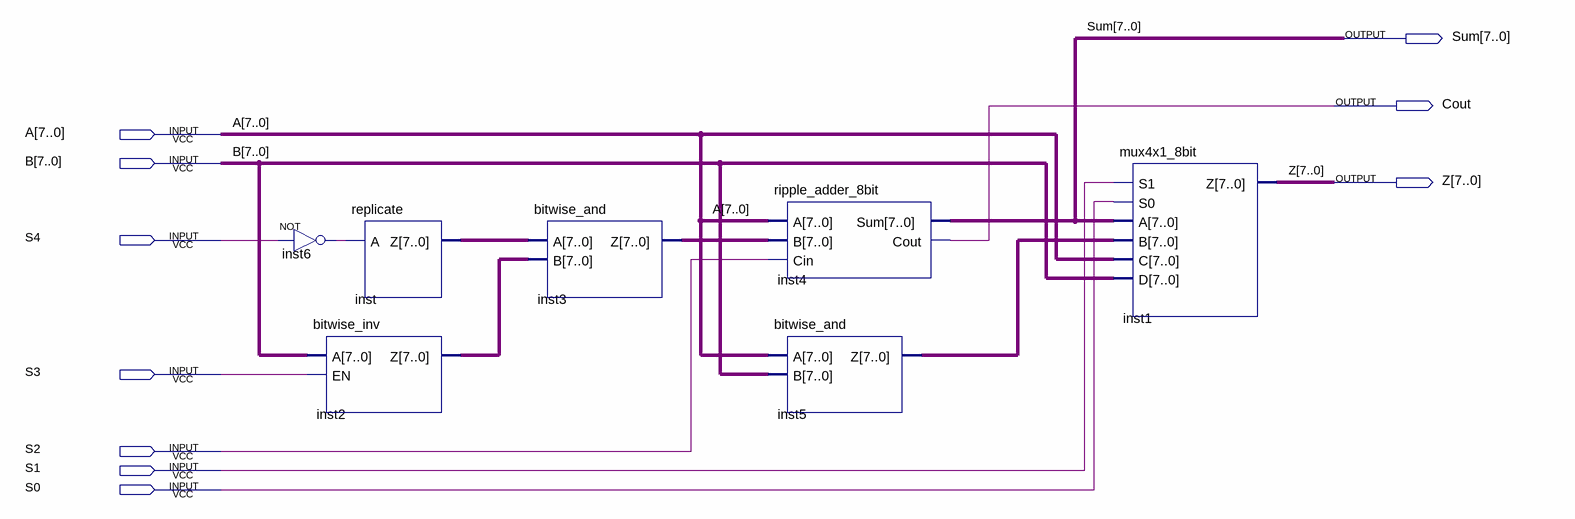
[diagram p0: schematic sheet]
// Quartus schematic ALU.bdf as structural Verilog: 7 symbols, 10 pins
module ALU (
  input  [7:0] A,
  input  [7:0] B,
  input  S4,
  input  S3,
  input  S2,
  input  S1,
  input  S0,
  output [7:0] Sum,
  output Cout,
  output [7:0] Z
);

  wire inst6_out;
  wire [7:0] inst2_z, inst3_z, inst5_z, inst_z;

  not inst6 (inst6_out, S4);
  replicate inst (.A(inst6_out), .Z(inst_z));
  bitwise_inv inst2 (.A(B), .EN(S3), .Z(inst2_z));
  bitwise_and inst3 (.A(inst_z), .B(inst2_z), .Z(inst3_z));
  ripple_adder_8bit inst4 (.A(A), .B(inst3_z), .Cin(S2), .Sum(Sum), .Cout(Cout));
  bitwise_and inst5 (.A(A), .B(B), .Z(inst5_z));
  mux4x1_8bit inst1 (.S1(S1), .S0(S0), .A(Sum), .B(inst5_z), .C(A), .D(B), .Z(Z));
endmodule
